# Altium schematic sheet schematic.SchDoc
size A; SheetNumber: 1; SheetTotal: 1
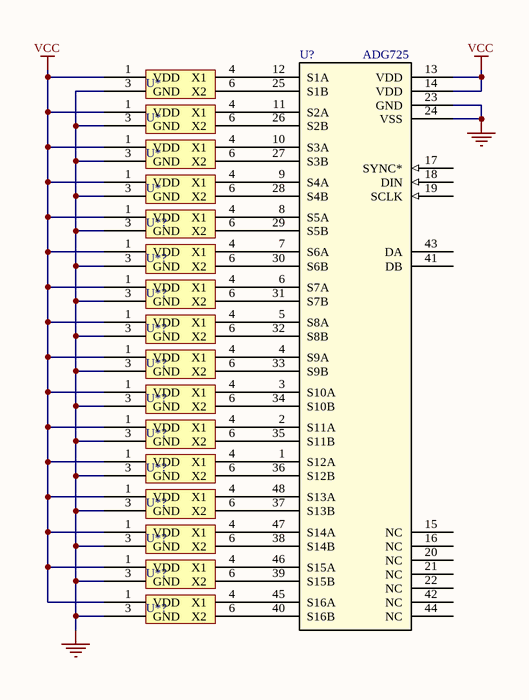
[diagram p0: schematic.SchDoc]

## Parts
(Parts that share a designator on the sheet are numbered #1, #2 ... from top to bottom, then left to right.)
U*#1  CT100  [SON_6_CT100]  (value not drawn)
U*#2  CT100  [SON_6_CT100]  (value not drawn)
U*#3  CT100  [SON_6_CT100]  (value not drawn)
U*#4  CT100  [SON_6_CT100]  (value not drawn)
U*?#1  CT100  [SON_6_CT100]  (value not drawn)
U*?#2  CT100  [SON_6_CT100]  (value not drawn)
U*?#3  CT100  [SON_6_CT100]  (value not drawn)
U*?#4  CT100  [SON_6_CT100]  (value not drawn)
U*?#5  CT100  [SON_6_CT100]  (value not drawn)
U*?#6  CT100  [SON_6_CT100]  (value not drawn)
U*?#7  CT100  [SON_6_CT100]  (value not drawn)
U*?#8  CT100  [SON_6_CT100]  (value not drawn)
U*?#9  CT100  [SON_6_CT100]  (value not drawn)
U*?#10  CT100  [SON_6_CT100]  (value not drawn)
U*?#11  CT100  [SON_6_CT100]  (value not drawn)
U*?#12  CT100  [SON_6_CT100]  (value not drawn)
U?  ADG725  [SU_48_ADI]

## Nets
GND: U*#1.3(GND) U*#2.3(GND) U*#3.3(GND) U*#4.3(GND) U*?#1.3(GND) U*?#2.3(GND) U*?#3.3(GND) U*?#4.3(GND) U*?#5.3(GND) U*?#6.3(GND) U*?#7.3(GND) U*?#8.3(GND) U*?#9.3(GND) U*?#10.3(GND) U*?#11.3(GND) U*?#12.3(GND) U?.23(GND) U?.24(VSS)
VCC: U*#1.1(VDD) U*#2.1(VDD) U*#3.1(VDD) U*#4.1(VDD) U*?#1.1(VDD) U*?#2.1(VDD) U*?#3.1(VDD) U*?#4.1(VDD) U*?#5.1(VDD) U*?#6.1(VDD) U*?#7.1(VDD) U*?#8.1(VDD) U*?#9.1(VDD) U*?#10.1(VDD) U*?#11.1(VDD) U*?#12.1(VDD) U?.13(VDD) U?.14(VDD)
NetU*#1_4: U*#1.4(X1) U?.12(S1A)
NetU*#1_6: U*#1.6(X2) U?.25(S1B)
NetU*#2_4: U*#2.4(X1) U?.11(S2A)
NetU*#2_6: U*#2.6(X2) U?.26(S2B)
NetU*#3_4: U*#3.4(X1) U?.10(S3A)
NetU*#3_6: U*#3.6(X2) U?.27(S3B)
NetU*#4_4: U*#4.4(X1) U?.9(S4A)
NetU*#4_6: U*#4.6(X2) U?.28(S4B)
NetU*?#1_4: U*?#1.4(X1) U?.8(S5A)
NetU*?#1_6: U*?#1.6(X2) U?.29(S5B)
NetU*?#2_4: U*?#2.4(X1) U?.7(S6A)
NetU*?#2_6: U*?#2.6(X2) U?.30(S6B)
NetU*?#3_4: U*?#3.4(X1) U?.6(S7A)
NetU*?#3_6: U*?#3.6(X2) U?.31(S7B)
NetU*?#4_4: U*?#4.4(X1) U?.5(S8A)
NetU*?#4_6: U*?#4.6(X2) U?.32(S8B)
NetU*?#5_4: U*?#5.4(X1) U?.4(S9A)
NetU*?#5_6: U*?#5.6(X2) U?.33(S9B)
NetU*?#6_4: U*?#6.4(X1) U?.3(S10A)
NetU*?#6_6: U*?#6.6(X2) U?.34(S10B)
NetU*?#7_4: U*?#7.4(X1) U?.2(S11A)
NetU*?#7_6: U*?#7.6(X2) U?.35(S11B)
NetU*?#8_4: U*?#8.4(X1) U?.1(S12A)
NetU*?#8_6: U*?#8.6(X2) U?.36(S12B)
NetU*?#9_4: U*?#9.4(X1) U?.48(S13A)
NetU*?#9_6: U*?#9.6(X2) U?.37(S13B)
NetU*?#10_4: U*?#10.4(X1) U?.47(S14A)
NetU*?#10_6: U*?#10.6(X2) U?.38(S14B)
NetU*?#11_4: U*?#11.4(X1) U?.46(S15A)
NetU*?#11_6: U*?#11.6(X2) U?.39(S15B)
NetU*?#12_4: U*?#12.4(X1) U?.45(S16A)
NetU*?#12_6: U*?#12.6(X2) U?.40(S16B)

Not connected (* = marked no-connect by the designer): U? 15(NC) 16(NC) 17(SYNC*) 18(DIN) 19(SCLK) 20(NC) 21(NC) 22(NC) 41(DB) 42(NC) 43(DA) 44(NC)

## Library data of the parts
U*#1-U*#4 U*?#1-U*?#12 = CT100LW-ID6-M: TMR Sensor, Linear, -40 to 85deg C; Manufacturer: Crocus Technology; Manufacturer Part Number: CT100LW-ID6; RoHS: Yes
U? = ADG725BSUZ: Differential 16-Channel, Serially Controlled 3.5 Ω 1.8 V to 5.5 V, ±2.5 V, Analog Multiplexer; Mfr_Name: Analog Devices Inc; Manufacturer_Part_Number: ADG725BSUZ; RefDes: RefDes; Type: DEV